# Altium schematic sheet Gate_Driver.SchDoc
size A4
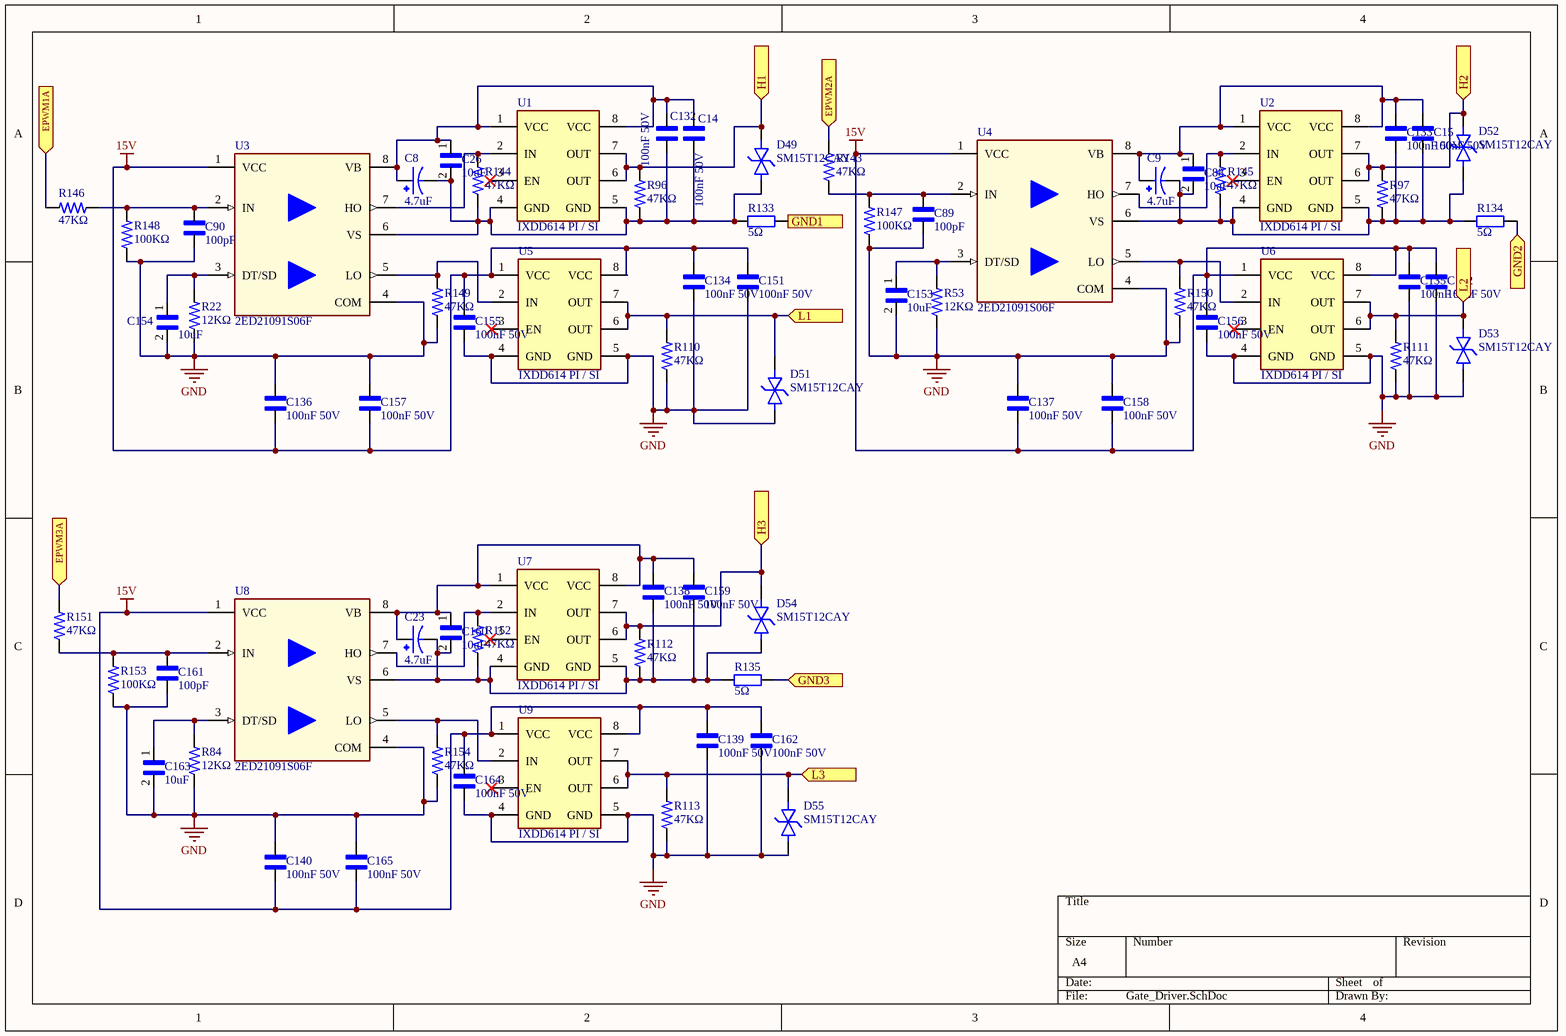
[diagram p0: Gate_Driver.SchDoc]

## Parts
C8  4.7uF  [CAP ALSMD POLY 4.3MM H5.5MM]
C9  4.7uF  [CAP ALSMD POLY 4.3MM H5.5MM]
C14  100nF 50V  [C-0805W]
C15  100nF 50V  [C-0805W]
C23  4.7uF  [CAP ALSMD POLY 4.3MM H5.5MM]
C26  10uF  [C-0805R]
C88  10uF  [C-0805R]
C89  100pF  [C-0805R]
C90  100pF  [C-0805R]
C132  100nF 50V  [C-0805W]
C133  100nF 50V  [C-0805W]
C134  100nF 50V  [C-0805W]
C135  100nF 50V  [C-0805W]
C136  100nF 50V  [C-0805W]
C137  100nF 50V  [C-0805W]
C138  100nF 50V  [C-0805W]
C139  100nF 50V  [C-0805W]
C140  100nF 50V  [C-0805W]
C151  100nF 50V  [C-0805W]
C152  100nF 50V  [C-0805W]
C153  10uF  [C-0805R]
C154  10uF  [C-0805R]
C155  100nF 50V  [C-0805W]
C156  100nF 50V  [C-0805W]
C157  100nF 50V  [C-0805W]
C158  100nF 50V  [C-0805W]
C159  100nF 50V  [C-0805W]
C160  10uF  [C-0805R]
C161  100pF  [C-0805R]
C162  100nF 50V  [C-0805W]
C163  10uF  [C-0805R]
C164  100nF 50V  [C-0805W]
C165  100nF 50V  [C-0805W]
D49  SM15T12CAY  [DIOM7959X262N]
D51  SM15T12CAY  [DIOM7959X262N]
D52  SM15T12CAY  [DIOM7959X262N]
D53  SM15T12CAY  [DIOM7959X262N]
D54  SM15T12CAY  [DIOM7959X262N]
D55  SM15T12CAY  [DIOM7959X262N]
R22  12KΩ  [R-1206W]
R53  12KΩ  [R-1206W]
R84  12KΩ  [R-1206W]
R96  47KΩ  [RESC3015X65N]
R97  47KΩ  [RESC3015X65N]
R110  47KΩ  [RESC3015X65N]
R111  47KΩ  [RESC3015X65N]
R112  47KΩ  [RESC3015X65N]
R113  47KΩ  [RESC3015X65N]
R133  5Ω  [R-1206W]
R134  5Ω  [R-1206W]
R135  5Ω  [R-1206W]
R143  47KΩ  [RESC3015X65N]
R144  47KΩ  [RESC3015X65N]
R145  47KΩ  [RESC3015X65N]
R146  47KΩ  [RESC3015X65N]
R147  100KΩ  [R-0805R]
R148  100KΩ  [R-0805R]
R149  47KΩ  [RESC3015X65N]
R150  47KΩ  [RESC3015X65N]
R151  47KΩ  [RESC3015X65N]
R152  47KΩ  [RESC3015X65N]
R153  100KΩ  [R-0805R]
R154  47KΩ  [RESC3015X65N]
U1  IXDD614 PI / SI  [SOIC8-IXD_614]
U2  IXDD614 PI / SI  [SOIC8-IXD_614]
U3  2ED21091S06F  [SOIC127P600X172-8N-1-V]
U4  2ED21091S06F  [SOIC127P600X172-8N-1-V]
U5  IXDD614 PI / SI  [SOIC8-IXD_614]
U6  IXDD614 PI / SI  [SOIC8-IXD_614]
U7  IXDD614 PI / SI  [SOIC8-IXD_614]
U8  2ED21091S06F  [SOIC127P600X172-8N-1-V]
U9  IXDD614 PI / SI  [SOIC8-IXD_614]

## Ports
EPWM1A (in), EPWM2A (in), EPWM3A (in), GND1 (in), GND2 (in), GND3 (in), H1 (in), H2 (in), H3 (in), L1 (in), L2 (in), L3 (in)

## Nets
15V: C134.2 C135.2 C136.1 C137.1 C139.2 C140.1 C151.2 C152.2 C155.2 C156.2 C157.1 C158.1 C162.2 C164.2 C165.1 U3.1(VCC) U4.1(VCC) U5.1(VCC) U5.8(VCC) U6.1(VCC) U6.8(VCC) U8.1(VCC) U9.1(VCC) U9.8(VCC)
GND: C89.1 C90.1 C134.1 C135.1 C136.2 C137.2 C139.1 C140.2 C151.1 C152.1 C153.2 C154.2 C155.1 C156.1 C157.2 C158.2 C161.1 C162.1 C163.2 C164.1 C165.2 D51.1 D53.1 D55.1 R22.1 R53.1 R84.1 R110.1 R111.1 R113.1 R147.1 R148.1 R149.1 R150.1 R153.1 R154.1 U3.4(COM) U4.4(COM) U5.4(GND) U5.5(GND) U6.4(GND) U6.5(GND) U8.4(COM) U9.4(GND) U9.5(GND)
EPWM1A: R146.2 ; port EPWM1A
EPWM2A: R143.2 ; port EPWM2A
EPWM3A: R151.2 ; port EPWM3A
GND1: R133.2 ; port GND1
GND2: R134.2 ; port GND2
GND3: R135.2 ; port GND3
H1: D49.2 R96.2 U1.6(OUT) U1.7(OUT) ; port H1
H2: D52.2 R97.2 U2.6(OUT) U2.7(OUT) ; port H2
H3: D54.2 R112.2 U7.6(OUT) U7.7(OUT) ; port H3
L1: D51.2 R110.2 U5.6(OUT) U5.7(OUT) ; port L1
L2: D53.2 R111.2 U6.6(OUT) U6.7(OUT) ; port L2
L3: D55.2 R113.2 U9.6(OUT) U9.7(OUT) ; port L3
NetC8_1: C8.1 C14.2 C26.1 C132.2 U1.1(VCC) U1.8(VCC) U3.8(VB)
NetC8_2: C8.2 C14.1 C26.2 C132.1 D49.1 R96.1 R133.1 R144.1 U1.4(GND) U1.5(GND) U3.6(VS)
NetC9_1: C9.1 C15.2 C88.1 C133.2 U2.1(VCC) U2.8(VCC) U4.8(VB)
NetC9_2: C9.2 C15.1 C88.2 C133.1 D52.1 R97.1 R134.1 R145.1 U2.4(GND) U2.5(GND) U4.6(VS)
NetC23_1: C23.1 C138.2 C159.2 C160.1 U7.1(VCC) U7.8(VCC) U8.8(VB)
NetC23_2: C23.2 C138.1 C159.1 C160.2 D54.1 R112.1 R135.1 R152.1 U7.4(GND) U7.5(GND) U8.6(VS)
NetC89_2: C89.2 R143.1 R147.2 U4.2(IN)
NetC90_2: C90.2 R146.1 R148.2 U3.2(IN)
NetC153_1: C153.1 R53.2 U4.3(DT/SD)
NetC154_1: C154.1 R22.2 U3.3(DT/SD)
NetC161_2: C161.2 R151.1 R153.2 U8.2(IN)
NetC163_1: C163.1 R84.2 U8.3(DT/SD)
NetR144_2: R144.2 U1.2(IN) U3.7(HO)
NetR145_2: R145.2 U2.2(IN) U4.7(HO)
NetR149_2: R149.2 U3.5(LO) U5.2(IN)
NetR150_2: R150.2 U4.5(LO) U6.2(IN)
NetR152_2: R152.2 U7.2(IN) U8.7(HO)
NetR154_2: R154.2 U8.5(LO) U9.2(IN)

Not connected (* = marked no-connect by the designer): U1 3(EN)*; U2 3(EN)*; U5 3(EN)*; U6 3(EN)*; U7 3(EN)*; U9 3(EN)*

## Library data of the parts
C8 C9 C23 = CAP 4.7uF
C14 C15 C132-C140 C151 C152 C155-C159 C162 C164 C165 = CAP 100nF 50V SMT 0805: WCAP-CSGP General Purpose MLCC; SMT 0805; X7R; 100nF 10%; 50V; -55C to +125C; Tech. PN X7R0805104K050DFCT10000; MF: Wurth Electronics Inc; MP: 885012207098; Availability: Warning; Mouser-Purchase-URL: https://snapeda.com/shop?store=Mouser&id=4217223; Price: None; DigiKey-Purchase-URL: https://snapeda.com/shop?store=DigiKey&id=4217223; Package: 0805 Wurth Electronics; Value: *; SnapEDA_Link: https://www.snapeda.com/parts/885012207098/Wurth%20Electronics%20Inc/view-part/4217223/?ref=snap; BuyPart: https://www.snapeda.com/parts/885012207098/Wurth%20Electronics%20Inc/view-part/4217223/?ref=eda
C26 C88 C153 C154 C160 C163 = CAP 10uF 0805 Ceramic: 0805 10 uF 10 V Â±10% Tolerance X7R Multilayer Ceramic Capacitor; MP: GCJ21BR71A106KE01L; MF: Murata; Package: 2012 Murata; Availability: Warning; SnapEDA_Link: https://www.snapeda.com/parts/GCJ21BR71A106KE01L/Murata%20Electronics%20North%20America/view-part/1756458/?ref=snap; Value: *; Purchase-URL: https://pricing.snapeda.com/search/part/GCJ21BR71A106KE01L/?ref=eda; Price: None; Check_prices: https://www.snapeda.com/parts/GCJ21BR71A106KE01L/Murata%20Electronics%20North%20America/view-part/1756458/?ref=eda
C89 C90 C161 = CAP 100PF 0805
D49 D51-D55 = SM15T12CAY: 21.7V Clamp 461A (8/20µs) Ipp Tvs Diode Surface Mount SMC; MP: SMBJ36CA-13-F; MF: Diodes Inc.; Package: DO-214 Diodes Inc.; Price: None; Value: *; SnapEDA_Link: https://www.snapeda.com/parts/SMBJ36CA-13-F/Diodes%20Inc./view-part/828964/?ref=snap; Availability: Unavailable
R22 R53 R84 = RES 12K 1206: Res Thick Film 1206 12K Ohm 1% 0.25W(1/4W) Â±100ppm/Â°C Pad SMD T/R; MF: TE Connectivity; MP: 1623417-1; SnapEDA_Link: https://www.snapeda.com/parts/1623417-1/TE%20Connectivity/view-part/2210700/?ref=snap; Price: None; EU_RoHS_Compliance: Compliant with Exemptions; Availability: Warning; Package: 1206; Value: *; Check_prices: https://www.snapeda.com/parts/1623417-1/TE%20Connectivity/view-part/2210700/?ref=eda
R96 R97 R110-R113 R143-R146 R149-R152 R154 = RES 47KΩ 1206: 47 kOhms ±1% 0.25W, 1/4W Chip Resistor 1206 (3216 Metric) Thick Film; MP: CRCW120647K0FKEAC; Package: None; Price: None; Value: *; Availability: Unavailable
R133-R135 = 5Ω 1206
R147 R148 R153 = RES 100KΩ 0805
U1 U2 U5-U7 U9 = IXD_614
U3 U4 U8 = 2ED21091S06F: 650 V half bridge gate driver with integrated bootstrap diode; Manufacturer: Infineon Technologies; Manufacturer Order Number: 2ED21091S06F; PackageReference: PG-DSO-8-53